# Altium schematic sheet VESC.SchDoc
size A4
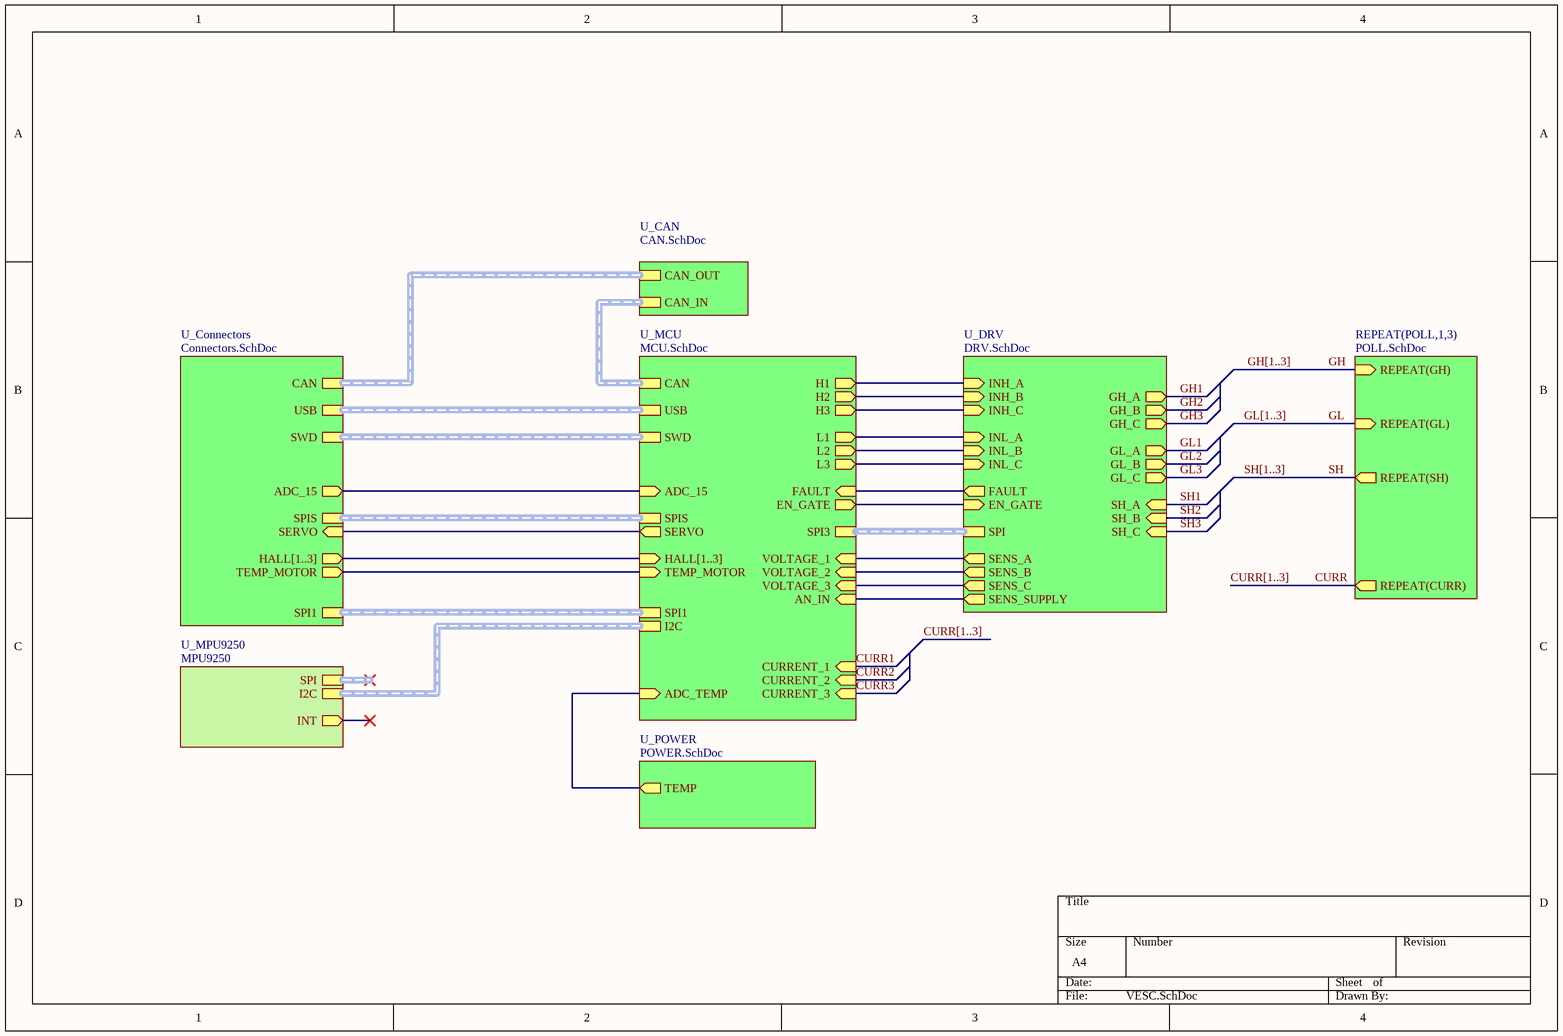
[diagram p0: VESC.SchDoc]

## Sub-sheets
REPEAT(POLL,1,3) = POLL.SchDoc: REPEAT(GH) (in), REPEAT(GL) (in), REPEAT(SH) (out), REPEAT(CURR) (out)
U_CAN = CAN.SchDoc: CAN_IN (harness CAN Input), CAN_OUT (harness CAN Output)
U_Connectors = Connectors.SchDoc: SERVO (in), SWD, USB, CAN (harness CAN Output), SPI1 (harness SPI), ADC_15 (out), HALL[1..3] (out), TEMP_MOTOR (out), SPIS (harness SPI)
U_DRV = DRV.SchDoc: INH_A (in), INH_B (in), INH_C (in), INL_A (in), INL_B (in), INL_C (in), SPI (harness SPI), SENS_A (out), SENS_B (out), SENS_C (out), SENS_SUPPLY (out), EN_GATE (in), FAULT (out), GH_A (out), GH_B (out), GH_C (out), GL_A (out), GL_B (out), GL_C (out), SH_A (in), SH_B (in), SH_C (in)
U_MCU = MCU.SchDoc: SERVO (out), SPI1 (harness SPI), SWD (harness SWD), USB (harness USB), CAN (harness CAN Input), H1 (out), H2 (out), H3 (out), L1 (out), L2 (out), L3 (out), FAULT (in), EN_GATE (out), VOLTAGE_1 (in), VOLTAGE_2 (in), VOLTAGE_3 (in), AN_IN (in), SPI3 (harness SPI), ADC_15 (in), HALL[1..3] (in), TEMP_MOTOR (in), CURRENT_1 (in), CURRENT_2 (in), CURRENT_3 (in), SPIS (harness SPI), ADC_TEMP (in), I2C (harness I2C)
U_MPU9250 = MPU9250: INT (out), SPI (harness SPI), I2C (harness SPI)
U_POWER = POWER.SchDoc: TEMP (out)

## Nets
CURR: sheet REPEAT(POLL,1,3)/REPEAT(CURR)
CURR1: sheet U_MCU/CURRENT_1
CURR2: sheet U_MCU/CURRENT_2
CURR3: sheet U_MCU/CURRENT_3
GH: sheet REPEAT(POLL,1,3)/REPEAT(GH)
GH1: sheet U_DRV/GH_A
GH2: sheet U_DRV/GH_B
GH3: sheet U_DRV/GH_C
GL: sheet REPEAT(POLL,1,3)/REPEAT(GL)
GL1: sheet U_DRV/GL_A
GL2: sheet U_DRV/GL_B
GL3: sheet U_DRV/GL_C
SH: sheet REPEAT(POLL,1,3)/REPEAT(SH)
SH1: sheet U_DRV/SH_A
SH2: sheet U_DRV/SH_B
SH3: sheet U_DRV/SH_C
(unnamed): sheet U_MCU/SERVO, sheet U_Connectors/SERVO
(unnamed): sheet U_MCU/H1, sheet U_DRV/INH_A
(unnamed): sheet U_MCU/H2, sheet U_DRV/INH_B
(unnamed): sheet U_MCU/H3, sheet U_DRV/INH_C
(unnamed): sheet U_MCU/L1, sheet U_DRV/INL_A
(unnamed): sheet U_MCU/L2, sheet U_DRV/INL_B
(unnamed): sheet U_MCU/L3, sheet U_DRV/INL_C
(unnamed): sheet U_MCU/FAULT, sheet U_DRV/FAULT
(unnamed): sheet U_MCU/EN_GATE, sheet U_DRV/EN_GATE
(unnamed): sheet U_MCU/VOLTAGE_1, sheet U_DRV/SENS_A
(unnamed): sheet U_MCU/VOLTAGE_2, sheet U_DRV/SENS_B
(unnamed): sheet U_MCU/VOLTAGE_3, sheet U_DRV/SENS_C
(unnamed): sheet U_MCU/AN_IN, sheet U_DRV/SENS_SUPPLY
(unnamed): sheet U_MCU/ADC_15, sheet U_Connectors/ADC_15
(unnamed): sheet U_MCU/TEMP_MOTOR, sheet U_Connectors/TEMP_MOTOR
(unnamed): sheet U_MCU/ADC_TEMP, sheet U_POWER/TEMP

## Buses and harness runs
bus CURR[1..3]
bus GH[1..3]
bus GL[1..3]
bus SH[1..3]
bus sheet U_Connectors/HALL[1..3] = sheet U_MCU/HALL[1..3]
harness sheet U_CAN/CAN_IN = sheet U_MCU/CAN
harness sheet U_CAN/CAN_OUT = sheet U_Connectors/CAN
harness sheet U_Connectors/SPI1 = sheet U_MCU/SPI1
harness sheet U_Connectors/SPIS = sheet U_MCU/SPIS
harness sheet U_Connectors/SWD = sheet U_MCU/SWD
harness sheet U_Connectors/USB = sheet U_MCU/USB
harness sheet U_DRV/SPI = sheet U_MCU/SPI3
harness sheet U_MCU/I2C = sheet U_MPU9250/I2C